# EAGLE design HAP-CU-LCD-1.0 (EAGLE 4.16)
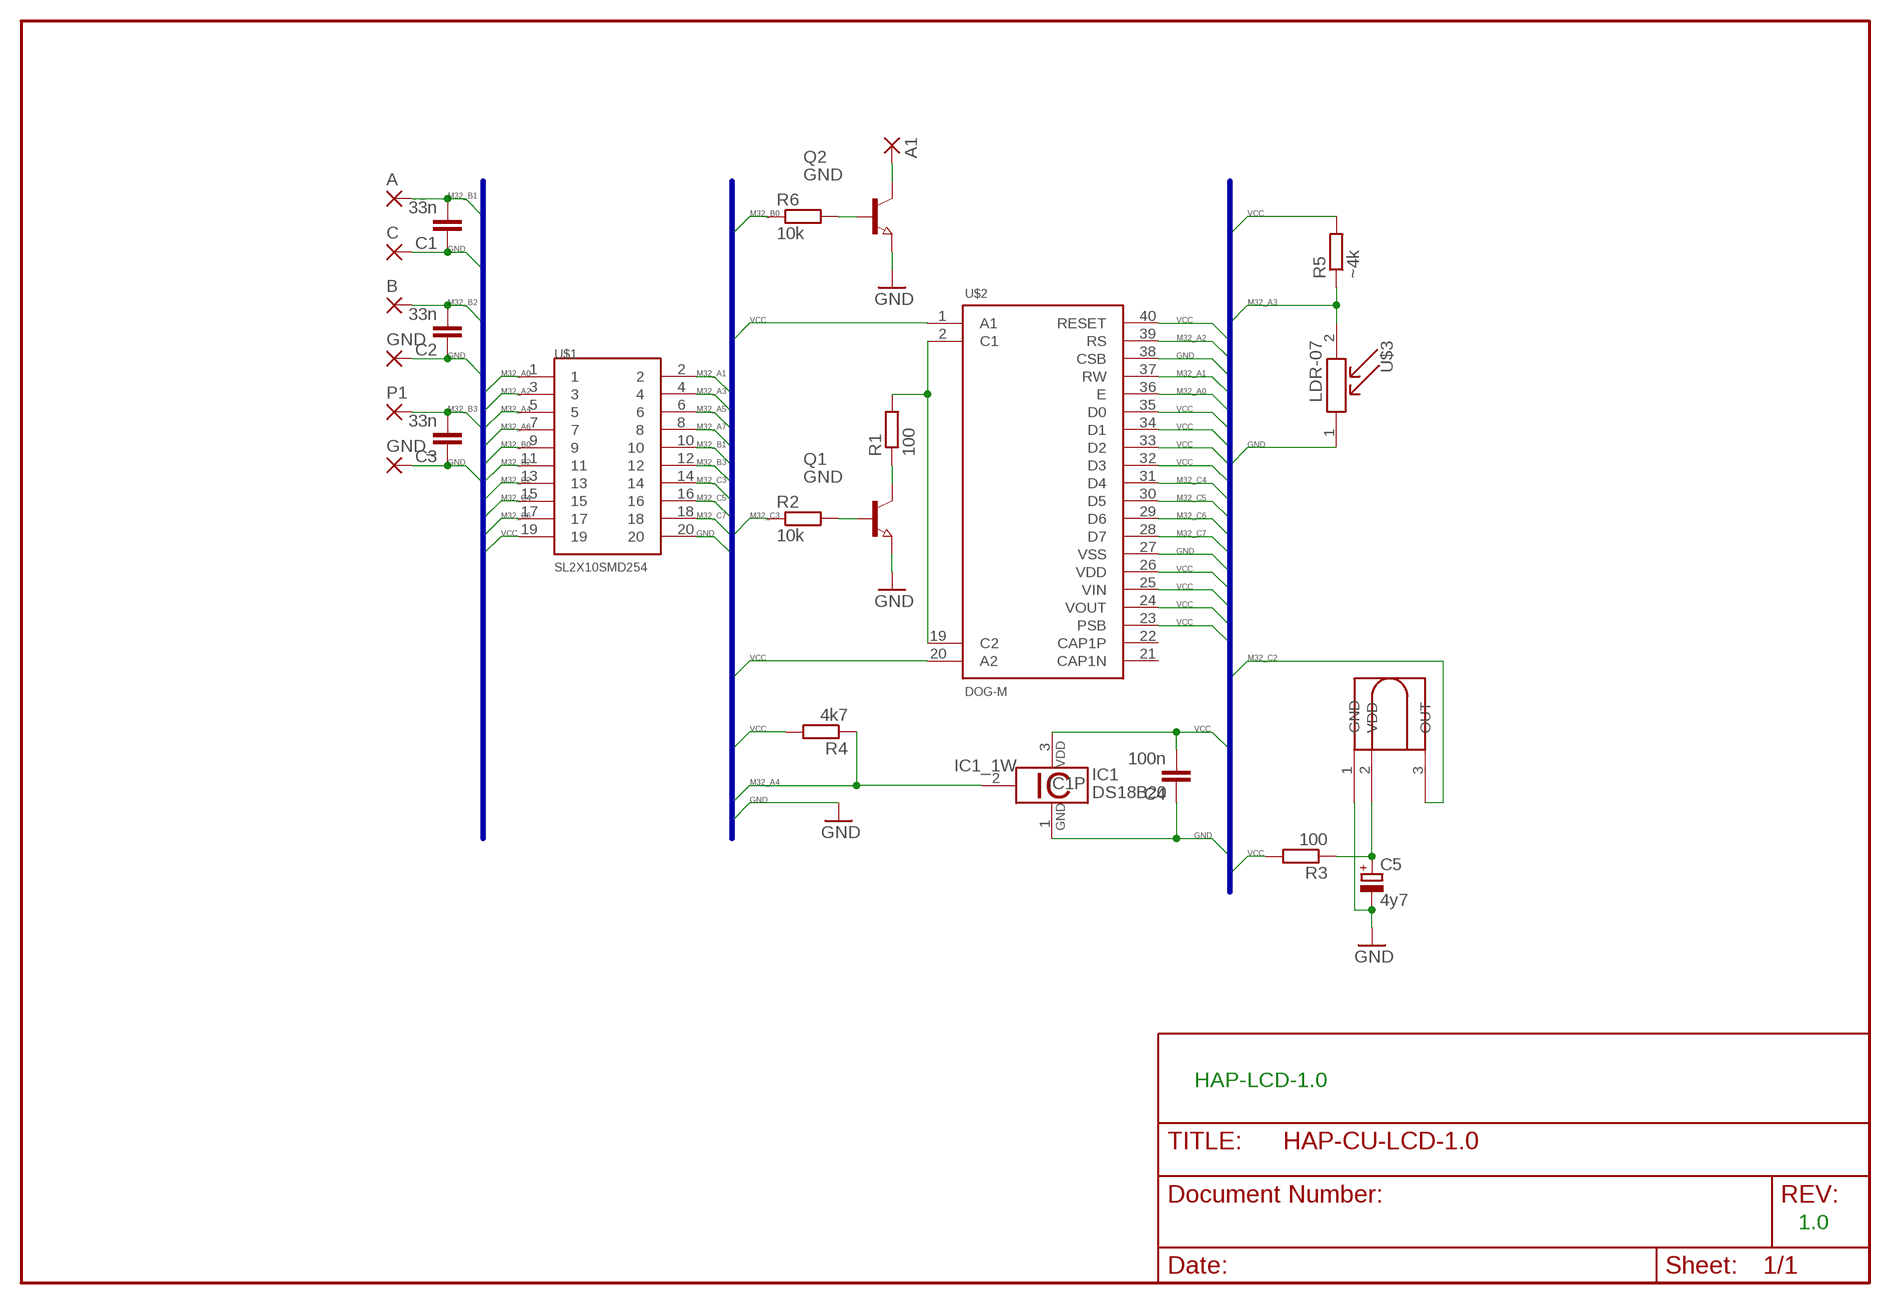
[diagram p0: schematic, sheet 1]

## Parts
A  SMD2  [SMD1,27-2,54]
A1  SMD2  [SMD1,27-2,54]
B  SMD2  [SMD1,27-2,54]
C  SMD2  [SMD1,27-2,54]
C1  33n  C-EUC0805  [C0805]
C2  33n  C-EUC0805  [C0805]
C3  33n  C-EUC0805  [C0805]
C4  100n  C-EUC0805  [C0805]
C5  4y7  CPOL-EU153CLV-0405  [153CLV-0405]
GND  SMD2  [SMD1,27-2,54]
GND_  SMD2  [SMD1,27-2,54]
IC1  DS18B20  [TO92-]
IC3  TSOP1738  [TSOPLIEGEND]
P1  SMD2  [SMD1,27-2,54]
Q1  GND  NPN-TRANSISTOR_SOT23  [SOT23]
Q2  GND  NPN-TRANSISTOR_SOT23  [SOT23]
R1  100  R-EU_R0805  [R0805]
R2  10k  R-EU_R0805  [R0805]
R3  100  R-EU_R0805  [R0805]
R4  4k7  R-EU_R0805  [R0805]
R5  ~4k  R-EU_0204/7  [0204/7]
R6  10k  R-EU_R0805  [R0805]
U$1  SL2X10SMD254  [SL2X10SMD254]
U$2  DOG-M  [DOG-M]
U$3  LDR-07  [LDR-07]

## Nets
GND: C1.1 C2.1 C3.1 C4.1 C5.- C.1(P) GND.1(P) GND_.1(P) IC1.1 IC3.1(GND) Q1.2(E) Q2.2(E) U$1.20 U$2.27(VSS) U$2.38(CSB) U$3.1
M32_A0: U$1.1 U$2.36(E)
M32_A1: U$1.2 U$2.37(RW)
M32_A2: U$1.3 U$2.39(RS)
M32_A3: R5.1 U$1.4 U$3.2
M32_A4: IC1.2 R4.1 U$1.5
M32_A5: U$1.6
M32_A6: U$1.7
M32_A7: U$1.8
M32_B0: R6.1 U$1.9
M32_B1: A.1(P) C1.2 U$1.10
M32_B2: B.1(P) C2.2 U$1.11
M32_B3: C3.2 P1.1(P) U$1.12
M32_C2: IC3.3(OUT) U$1.13
M32_C3: R2.1 U$1.14
M32_C4: U$1.15 U$2.31(D4)
M32_C5: U$1.16 U$2.30(D5)
M32_C6: U$1.17 U$2.29(D6)
M32_C7: U$1.18 U$2.28(D7)
N$1: R1.2 U$2.2(C1) U$2.19(C2)
N$2: Q1.3(C) R1.1
N$3: Q1.1(B) R2.2
N$4: C5.+ IC3.2(VDD) R3.1
N$6: A1.1(P) Q2.3(C)
N$7: Q2.1(B) R6.2
VCC: C4.2 IC1.3 R3.2 R4.2 R5.2 U$1.19 U$2.1(A1) U$2.20(A2) U$2.23(PSB) U$2.24(VOUT) U$2.25(VIN) U$2.26(VDD) U$2.32(D3) U$2.33(D2) U$2.34(D1) U$2.35(D0) U$2.40(RESET)
Unconnected: U$2.21(CAP1N) U$2.22(CAP1P)

## Buses
M32_RESET,M32_XTAL2,M32_XTAL1,M32_AREF,M32_AVCC,M32_AGND,M32_A[0..7],M32_B[0..7],M32_C[0..7],M32_D[0..7],VCC,GND,TXCAN,RXCAN,CANH,CANHB,CANL,CANLB,VCCSUPPLY,M32_XTAL1,M32_XTAL2,MCP_OSC1,MCP_OSC2,AREF

## Notes on the sheet
- HAP-LCD-1.0
- 1.0

## Library data of the parts
A A1 B C GND GND_ P1 = wirepad:SMD2: SMD PAD
C1-C4 = rcl:C-EU: CAPACITOR, European symbol
C5 = rcl:CPOL-EU: POLARIZED CAPACITOR, European symbol
IC1 = 1wire:DS18B20: Programmable Resolution Digital Thermometer This chip provides a onewire thermosensor with approx. 0.5°C accuracy. A programmable over/undertemperure alarm is available. The precision can be set from 9..12 bits. Notes: Vdd must be applied for accurate measurements at low temperatures, as the parasite power circuit otherwise heats the sensor. If parasite power is used, Vdd has to be connected to GND. The DS1822 is a low-cost thermometer chip, the DS18S20 is similar to the DS18B20, but with 9 Bit precision only. Author: Jan Kandziora <jjj@gmx.de>
IC3 = TSOP1738:TSOP1738
Q1 Q2 = semicon-smd-ipc:NPN-TRANSISTOR_: NPN TRANSISTOR
R1-R6 = rcl:R-EU_: RESISTOR, European symbol
U$1 = PinheadSMD:SL2X10SMD254
U$2 = dog-m:DOG-M
U$3 = ldr-07:LDR-07

## Net classes
1 Mains: width 2.997 mm, drill 1.27 mm
2 VCCSUPPLY: width 0.508 mm, drill 0.254 mm

## Board
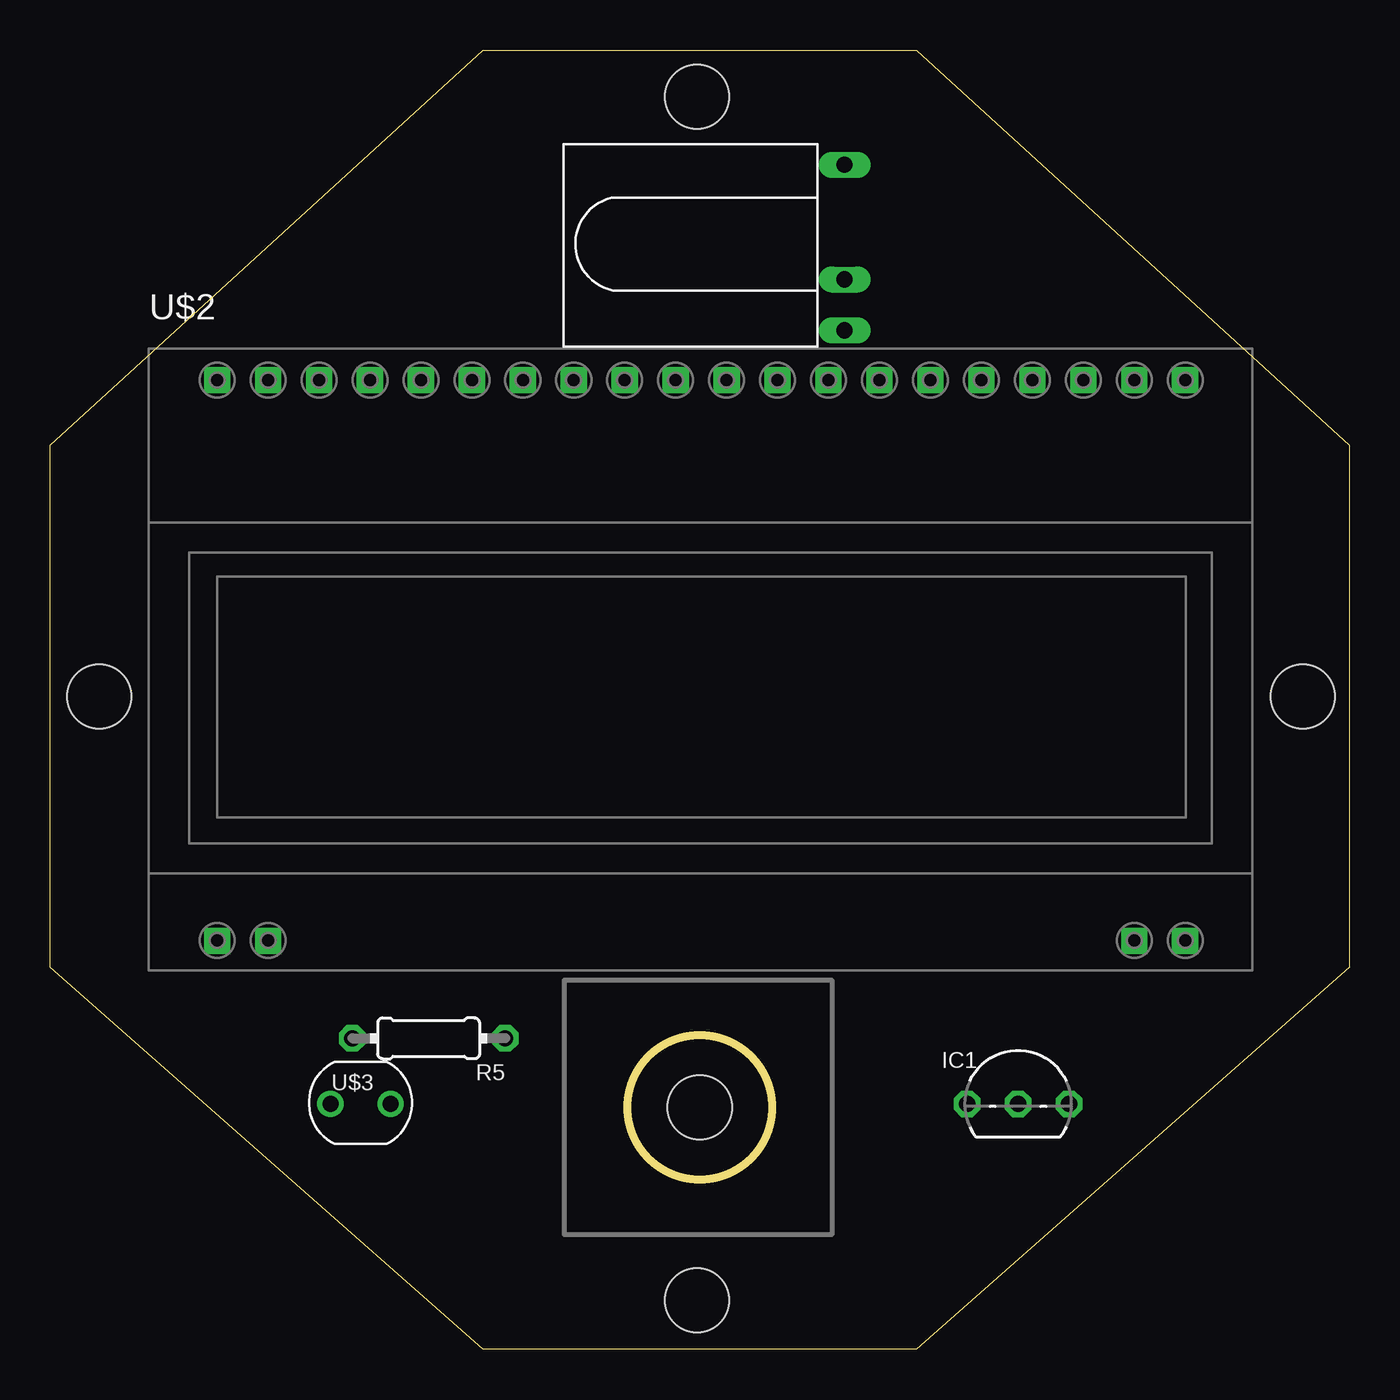
[diagram p1: board, top side]
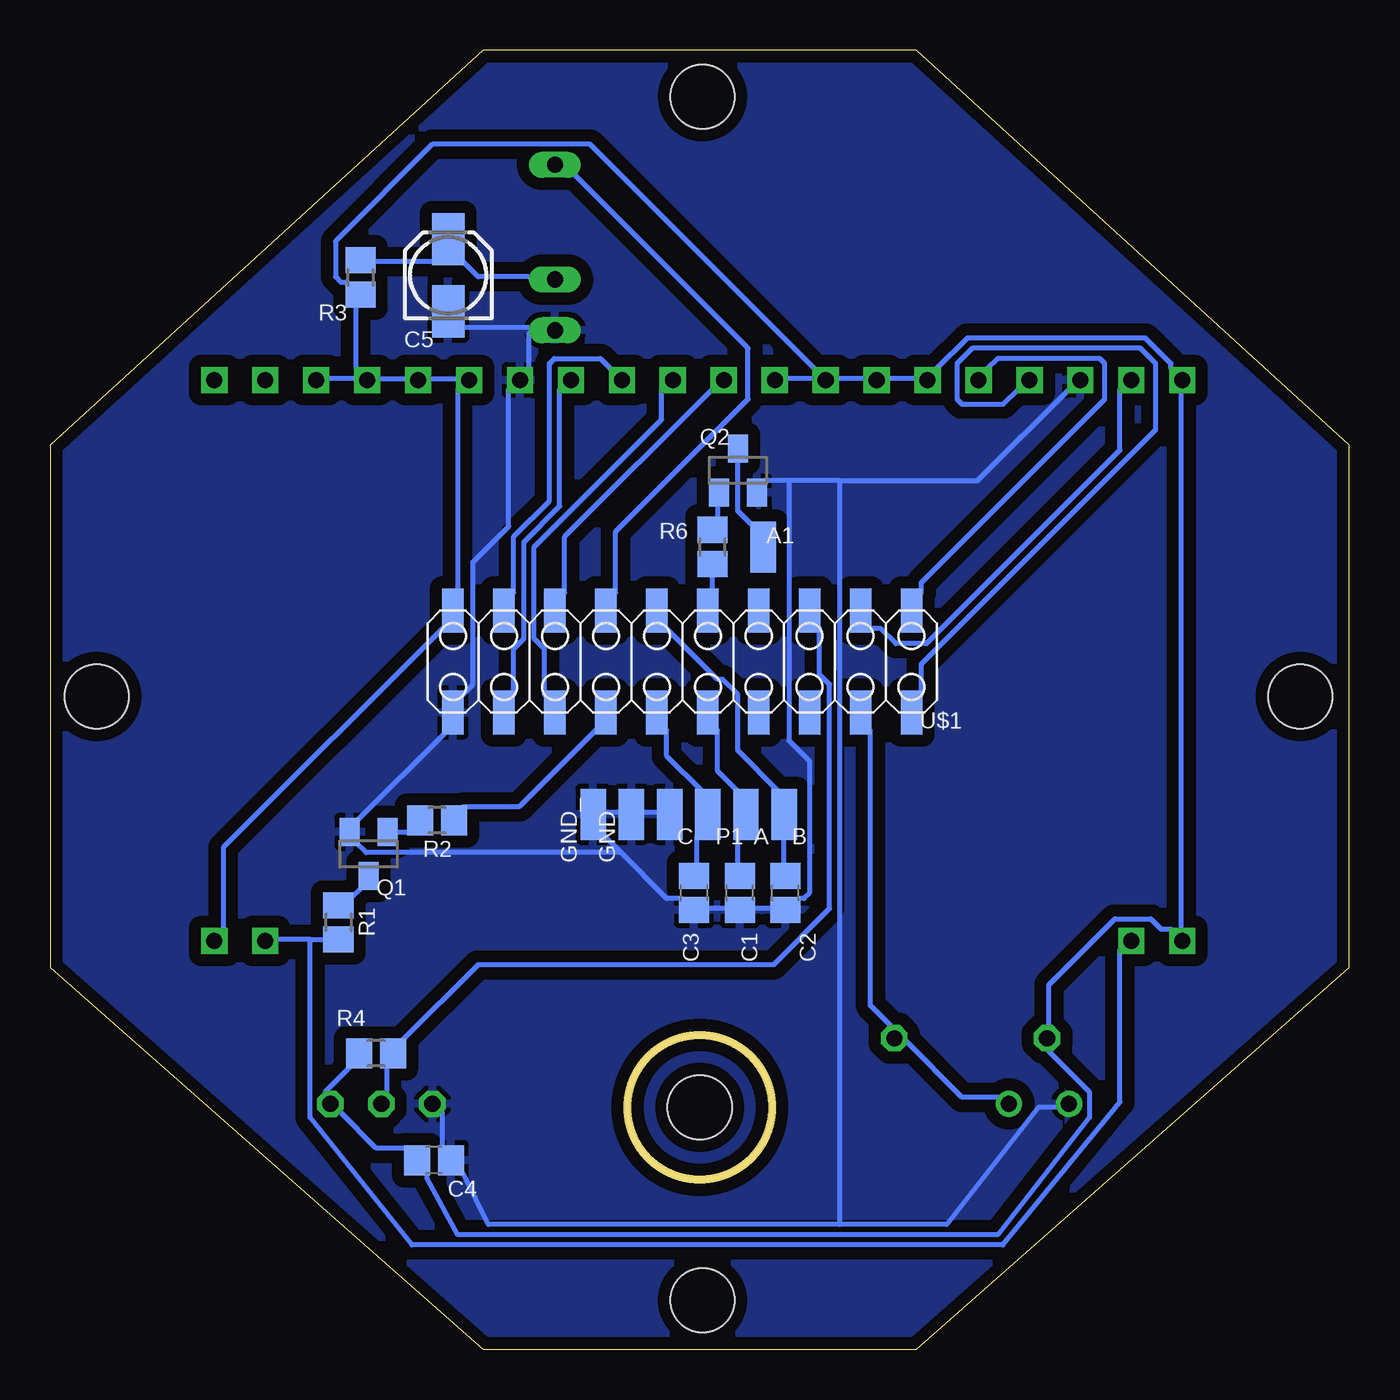
[diagram p2: board, bottom side, seen from below]

Size 64.77 x 64.77 mm. Coordinates in mm from the lower left corner, seen from the top.
Outline: 21.59,64.77 43.18,64.77 64.77,45.08 64.77,19.05 43.18,0 21.59,0 0,19.05 0,45.08 21.59,64.77
Outline: circle at 32.39,12.07 radius 3.59
Copper layers (1*16): Top 0.035mm / dielectric 1.5mm / Bottom 0.035mm
Design rules "default": minimum track width 10mil, minimum drill 24mil, track to track 8mil, track to pad 8mil, pad to pad 8mil, via to via 8mil, smd to smd 8mil, copper to edge 10mil, drill to drill 8mil, minimum pad ring 10mil, minimum via ring 8mil, stop-mask expansion 4mil, vias tented up to drill 0mil, thermal gap 10mil
Holes 3.2 mm at 2.45,32.55 62.45,32.55 32.25,2.45 32.25,62.44 32.39,12.07

### Footprints (pad centres in the part's own frame; a part is rotated, then mirrored left to right if it is on the bottom)
SMD1,27-2,54 = smd 1.27 x 2.54: 1 0,0
C0805 = smd 1.3 x 1.5: 1 -0.85,0; 2 0.85,0
153CLV-0405 = smd 2.6 x 1.6: + 1.8,0; - -1.8,0
TO92- = drill 0.813 octagon: 1 -2.54,0; 2 0,0; 3 2.54,0
TSOPLIEGEND = drill 0.8 long: 1 0,-1.27; 2 0,1.27; 3 0,6.985
SOT23 = smd 1 x 1.4: 1 -0.95,-1.1; 2 0.95,-1.1; 3 0,1.1
R0805 = smd 1.3 x 1.5: 1 -0.85,0; 2 0.85,0
0204/7 = drill 0.813 octagon: 1 -3.81,0; 2 3.81,0
SL2X10SMD254 = smd 1.067 x 2.184: 1 -10.16,-2.54; 2 -10.16,2.54; 3 -7.62,-2.54; 4 -7.62,2.54; 5 -5.08,-2.54; 6 -5.08,2.54; 7 -2.54,-2.54; 8 -2.54,2.54; 9 0,-2.54; 10 0,2.54; 11 2.54,-2.54; 12 2.54,2.54; 13 5.08,-2.54; 14 5.08,2.54; 15 7.62,-2.54; 16 7.62,2.54; 17 10.16,-2.54; 18 10.16,2.54; 19 12.7,-2.54; 20 12.7,2.54
DOG-M = drill 0.8 square: 1 -51.6,-29.96; 2 -49.06,-29.96; 19 -5.88,-29.96; 20 -3.34,-29.96; 21 -3.34,-2.01; 22 -5.88,-2.01; 23 -8.42,-2.01; 24 -10.96,-2.01; 25 -13.5,-2.01; 26 -16.04,-2.01; 27 -18.58,-2.01; 28 -21.12,-2.01; 29 -23.66,-2.01; 30 -26.2,-2.01; 31 -28.74,-2.01; 32 -31.28,-2.01; 33 -33.82,-2.01; 34 -36.36,-2.01; 35 -38.9,-2.01; 36 -41.44,-2.01; 37 -43.98,-2.01; 38 -46.52,-2.01; 39 -49.06,-2.01; 40 -51.6,-2.01
LDR-07 = drill 0.8 round: 1 1.279,-2.532; 2 4.279,-2.532

### Placement (x,y rotation side)
A  30.08,26.67 0 bottom
A1  29.21,40 0 bottom
B  28.18,26.67 0 bottom
C  33.89,26.67 0 bottom
C1  30.39,22.75 90 bottom
C2  28.11,22.75 90 bottom
C3  32.67,22.75 90 bottom
C4  45.64,9.43 180 bottom
C5  44.92,53.55 90 bottom
GND  35.8,26.67 0 bottom
GND_  37.7,26.67 0 bottom
IC1  48.26,12.24 0 top
IC3  39.61,52.07 0 top
P1  31.98,26.67 0 bottom
Q1  48.89,24.7 180 bottom
Q2  30.48,43.81 0 bottom
R1  50.4,21.29 270 bottom
R2  45.48,26.37 180 bottom
R3  49.3,53.44 270 bottom
R4  48.53,14.76 180 bottom
R5  18.87,15.5 180 top
R6  31.75,40 90 bottom
U$1  31.98,34.29 180 bottom
U$2  59.92,50.33 0 top
U$3  12.7,14.78 0 top

### Tracks (layer width: path | path; a pad name or v marks a point on that pad's centre or on a via)
GND
  Bottom 0.254: C5.- 44.2,50.93 40.89,50.93 IC3.1 40.89,50.67 40.89,48.89 U$2.27 41.91,47.88 41.91,41.02 43.69,39.24 43.69,33.15 44.2,32.64 U$1.20 44.96,30.86 49.53,26.29 Q1.2 49.53,25.27 49.02,24.77 36.32,24.77 | C.1 34.29,26.8 35.31,26.8 GND.1 36.32,26.8 37.08,26.8 GND_.1 37.08,25.53 36.32,24.77 | 36.32,24.77 34.04,22.48 33.27,22.48 C3.1 32,21.97 30.99,21.97 C1.1 29.72,21.97 28.7,21.97 C2.1 27.43,22.48 27.18,22.48 26.92,22.73 26.92,29.34 27.94,30.35 27.94,43.31 | 25.4,43.31 18.54,43.31 13.97,47.88 U$2.38 | 25.4,43.31 27.94,43.31 | 27.94,43.31 29.21,43.31 Q2.2 | IC1.1 45.21,11.81 45.21,10.03 C4.1 44.2,8.76 42.93,6.22 25.4,6.22 | 25.4,6.22 20.07,6.22 15.49,12.07 14.48,12.07 U$3.1 | 25.4,6.22 25.4,43.31
  pour Bottom (isolate 0.61): 0,45.08 21.59,64.13 43.18,64.13 64.77,45.08 64.77,18.42 44.45,0.64 20.32,0.64 0,18.42
M32_A0
  Bottom 0.254: U$1.1 21.34,37.72 21.34,38.23 12.19,47.37 12.19,49.15 12.45,49.4 17.53,49.4 18.03,48.89 U$2.36
M32_A1
  Bottom 0.254: U$1.2 21.34,32.64 21.34,34.16 9.65,45.85 9.65,49.15 10.41,49.91 18.8,49.91 19.56,49.15 19.56,47.37 19.3,47.12 17.27,47.12 16.51,47.88 U$2.37
M32_A2
  Bottom 0.254: U$1.3 23.88,35.94 23.37,35.94 22.61,35.18 21.08,35.18 11.43,44.83 11.43,47.88 U$2.39
M32_A3
  Bottom 0.254: U$1.4 23.88,30.86 23.88,17.14 22.86,16.13 R5.1 22.1,15.37 19.3,12.57 17.53,12.57 U$3.2
M32_A4
  Bottom 0.254: IC1.2 48.01,12.83 48.01,14.1 R4.1 47.24,15.37 43.43,19.18 28.7,19.18 25.91,21.97 25.91,33.15 26.42,33.66 26.42,35.94 U$1.5
M32_B0
  Bottom 0.254: R6.1 31.75,37.72 U$1.9
M32_B1
  Bottom 0.254: C1.2 30.48,24 30.48,25.53 A.1 30.48,27.81 31.5,28.83 31.5,30.86 U$1.10
M32_B2
  Bottom 0.254: C2.2 28.19,24 28.19,25.53 B.1 28.45,27.81 30.48,29.85 30.48,32.64 31.24,33.4 31.5,33.4 34.04,35.94 U$1.11
M32_B3
  Bottom 0.254: C3.2 32.51,24 32.51,25.53 P1.1 32.26,27.81 34.04,29.59 34.04,30.86 U$1.12
M32_C2
  Bottom 0.254: U$1.13 36.58,37.72 36.58,40.77 29.97,47.37 29.97,49.91 38.61,58.55 IC3.3
M32_C3
  Bottom 0.254: R2.1 44.2,27.05 41.4,27.05 37.59,30.86 U$1.14
M32_C4
  Bottom 0.254: U$1.15 39.12,37.72 39.12,40.51 31.75,47.88 U$2.31
M32_C5
  Bottom 0.254: U$1.16 40.13,32.64 40.13,34.92 40.64,35.43 40.64,40 34.29,46.36 34.29,47.88 U$2.30
M32_C6
  Bottom 0.254: U$1.17 41.66,37.72 41.66,40.51 39.88,42.29 39.88,49.15 39.62,49.4 37.34,49.4 36.83,48.89 U$2.29
M32_C7
  Bottom 0.254: U$1.18 41.66,32.64 41.66,34.92 41.15,35.43 41.15,40.26 39.37,42.04 39.37,47.88 U$2.28
N$1
  Bottom 0.254: 51.82,20.45 53.59,20.45 U$2.19 | 51.82,20.45 51.05,20.45 R1.2 | 51.82,20.45 51.82,11.56 46.74,5.21 17.27,5.21 11.43,12.32 11.43,19.94 U$2.2
N$2
  Bottom 0.254: Q1.3 49.28,22.99 49.78,22.48 R1.1
N$3
  Bottom 0.254: Q1.1 47.5,25.78 46.74,25.78 R2.2
N$4
  Bottom 0.254: R3.1 48.77,54.23 45.47,54.23 C5.+ 44.2,54.23 43.43,53.47 40.89,53.47 IC3.2
N$6
  Bottom 0.254: Q2.3 30.48,41.78 29.72,41.02 A1.1
N$7
  Bottom 0.254: Q2.1 31.5,42.04 31.5,41.28 R6.2
VCC
  Bottom 0.254: U$2.24 49.53,48.89 49.53,51.94 R3.2 50.04,53.21 50.29,53.21 50.55,53.47 50.55,55.25 45.72,60.07 37.85,60.07 26.67,48.89 U$2.33 | U$2.24 48.51,48.39 46.99,48.39 U$2.25 45.97,48.39 44.45,48.39 U$2.26 44.45,47.88 44.45,37.72 U$1.19 45.21,35.94 56.13,25.02 56.13,20.96 U$2.20 | U$2.23 51.05,48.39 49.53,48.39 U$2.24 | U$2.33 25.65,48.39 24.13,48.39 U$2.34 23.11,48.39 21.59,48.39 U$2.35 20.57,48.89 19.05,50.42 10.16,50.42 8.89,49.15 8.89,48.89 U$2.40 8.38,47.88 8.38,20.96 U$2.1 8.89,20.96 9.4,20.96 9.91,21.46 11.68,21.46 14.99,18.16 14.99,16.13 R5.2 14.99,14.86 12.95,12.83 12.95,11.56 17.53,5.71 44.45,5.71 45.97,8.51 45.97,8.76 C4.2 46.99,10.03 48.51,10.03 50.29,11.81 IC1.3 51.05,12.83 49.78,14.1 R4.2 | U$2.32 28.19,48.39 26.67,48.39 U$2.33